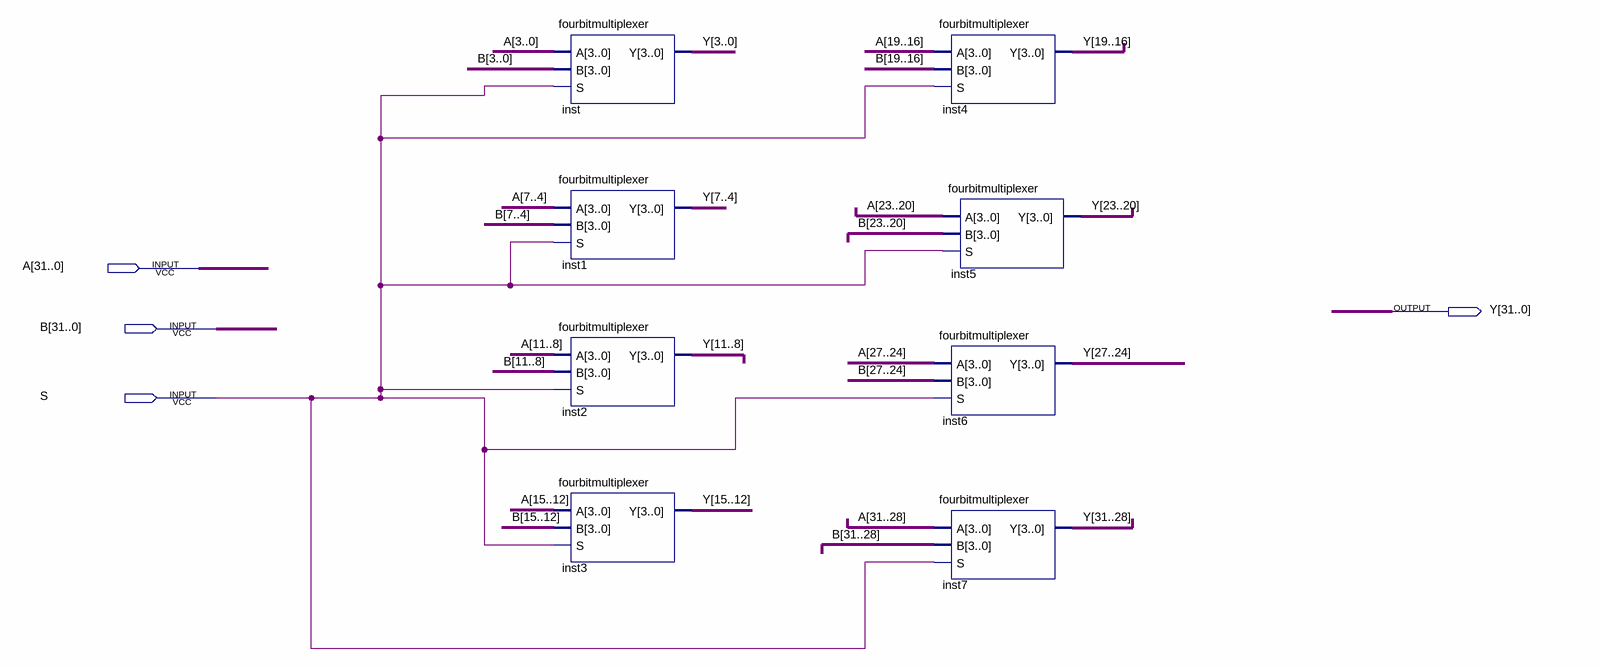
[diagram p0: schematic sheet]
// Quartus schematic thirtytwobitmultiplexer.bdf as structural Verilog: 8 symbols, 4 pins
module thirtytwobitmultiplexer (
  input  [31:0] A,
  input  [31:0] B,
  input  S,
  output [31:0] Y
);

  fourbitmultiplexer inst (.A(A[3:0]), .B(B[3:0]), .S(S), .Y(Y[3:0]));
  fourbitmultiplexer inst1 (.A(A[7:4]), .B(B[7:4]), .S(S), .Y(Y[7:4]));
  fourbitmultiplexer inst2 (.A(A[11:8]), .B(B[11:8]), .S(S), .Y(Y[11:8]));
  fourbitmultiplexer inst3 (.A(A[15:12]), .B(B[15:12]), .S(S), .Y(Y[15:12]));
  fourbitmultiplexer inst4 (.A(A[19:16]), .B(B[19:16]), .S(S), .Y(Y[19:16]));
  fourbitmultiplexer inst5 (.A(A[23:20]), .B(B[23:20]), .S(S), .Y(Y[23:20]));
  fourbitmultiplexer inst6 (.A(A[27:24]), .B(B[27:24]), .S(S), .Y(Y[27:24]));
  fourbitmultiplexer inst7 (.A(A[31:28]), .B(B[31:28]), .S(S), .Y(Y[31:28]));
endmodule
